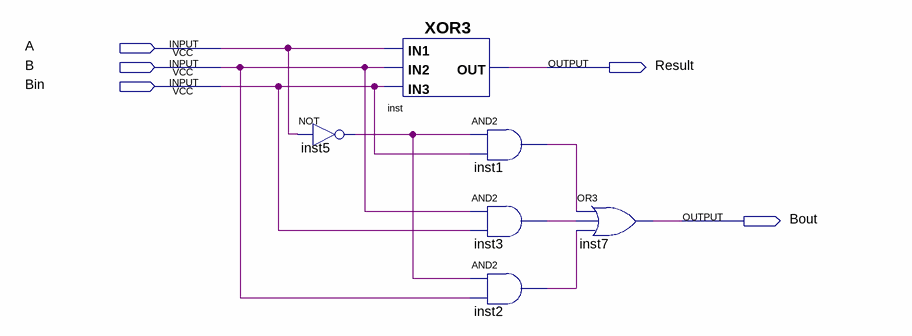
[diagram p0: schematic sheet]
// Quartus schematic 1BitSub.bdf as structural Verilog: 6 symbols, 5 pins
module \1BitSub  (
  input  A,
  input  B,
  input  Bin,
  output Result,
  output Bout
);

  wire inst1_out, inst2_out, inst3_out, inst5_out;

  not inst5 (inst5_out, A);
  XOR3 inst (.IN3(Bin), .IN1(A), .IN2(B), .OUT(Result));
  and inst1 (inst1_out, inst5_out, Bin);
  and inst3 (inst3_out, B, Bin);
  and inst2 (inst2_out, inst5_out, B);
  or inst7 (Bout, inst1_out, inst3_out, inst2_out);
endmodule
